# Altium project USB_TTL_1.1.PrjPcb
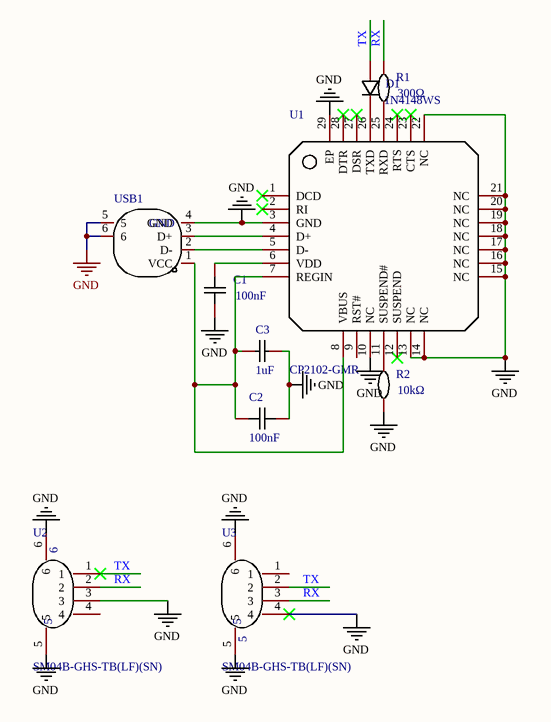
[diagram p0: usb_ttl.schdoc]
1 sheet, 10 parts. Net scope: global (net labels, ports and power ports of the same name join across sheets).
Board file: usb_ttl.pcbdoc

## Sheet usb_ttl.schdoc
size 309 x 223 mm; Symbol: Sheet-Symbol_A4; Device: Sheet-Symbol_A4; @Page Name: P1; @Create Date: 2023-03-03; @Page Count: 1; @Page No: 1; @Project Name: 防倒灌USB-TTL; @Schematic Name: Schematic1; @Update Date: 2023-03-03; Company: 嘉立创EDA; Page Size: A4; Version: V1.0; SheetNumber: 1; SheetTotal: 1

### Parts
C1  100nF  [C0402]
C2  100nF  [C0603]
C3  1uF  [C0603]
D1  1N4148WS  [SOD-323_L1.8-W1.3-LS2.5-RD]
R1  300Ω  [R0603]
R2  10kΩ  [R0402]
U1  CP2102-GMR  [WQFN-28_L5.0-W5.0-P0.50-BL-EP3.2]
U2  NAME: 5  NUMBER: 6  [CONN-SMD_4P-P1.25_SM04B-GHS-TB-LF-SN]  (hidden comment: SM04B-GHS-TB(LF)(SN))
U3  NAME: 5  [CONN-SMD_4P-P1.25_SM04B-GHS-TB-LF-SN]  (hidden comment: SM04B-GHS-TB(LF)(SN))
USB1  NAME: GND  [USB-A-SMD_917-P81A102ES60200]  (hidden comment: 917-P81A102ES60200)

### Nets
GND: C1.1 C2.1 C3.1 R2.1 U1.3(GND) U1.10(NC) U1.13(NC) U1.14(NC) U1.15(NC) U1.16(NC) U1.17(NC) U1.18(NC) U1.19(NC) U1.20(NC) U1.21(NC) U1.22(NC) U1.29(EP) U2.3 U2.5 U2.6 U3.4 U3.5 U3.6 USB1.4(GND) USB1.5 USB1.6
RX: R1.2 U2.2 U3.3
TX: D1.2(A) U2.1 U3.2
NetC1_2: C1.2 U1.6(VDD)
NetC2_2: C2.2 C3.2 U1.7(REGIN) U1.8(VBUS) USB1.1(VCC)
NetD1_1: D1.1(K) U1.26(TXD)
NetR1_1: R1.1 U1.25(RXD)
NetR2_2: R2.2 U1.11(SUSPEND#)
NetU1_4: U1.4(D+) USB1.3(D+)
NetU1_5: U1.5(D-) USB1.2(D-)

Not connected (* = marked no-connect by the designer): U1 1(DCD)* 2(RI)* 9(RST#) 12(SUSPEND)* 23(CTS)* 24(RTS)* 27(DSR)* 28(DTR)*; U2 4; U3 1

### Notes on the sheet
- 1
- 2
- 3
- 4
- 5
- 6
- A
- B
- C
- Schematic
- Schematic1
- Create Date
- Update Date
- 2023-03-03
- Reviewed
- Drawed
- Page
- P1
- Part Number
- 防倒灌USB-TTL
- D
- VER
- SIZE
- PAGE
- OF
- V1.0
- A4
- 嘉立创EDA

### Library data of the parts
C1 = CL05B104KB54PNC: 容值:100nF;精度:±10%;额定电压:50V;材质(温度系数):X7R;; Manufacturer: SAMSUNG(三星); Add into BOM: yes; Tolerance: ±10%; Voltage Rated: 50V; Temperature Coefficient: X7R; Name: 100nF; Symbol: CL05B104KB54PNC; Device: CL05B104KB54PNC; LCSC Part Name: 100nF ±10% 50V; Supplier Part: C307331; Manufacturer Part: CL05B104KB54PNC; Supplier Footprint: 0402; JLCPCB Part Class: Basic Part; Datasheet: https://atta.szlcsc.com/upload/public/pdf/source/20181009/C307331_222F7C870FD3EA5F46F538B483443886.pdf; Supplier: LCSC; Convert to PCB: yes; Value: 100nF
C2 = CC0603KRX7R9BB104: 容值:100nF;精度:±10%;额定电压:50V;材质(温度系数):X7R;; Manufacturer: YAGEO(国巨); Add into BOM: yes; Tolerance: ±10%; Voltage Rated: 50V; Temperature Coefficient: X7R; Name: 100nF; Symbol: CC0603KRX7R9BB104; Device: CC0603KRX7R9BB104; LCSC Part Name: 100nF ±10% 50V; Supplier Part: C14663; Manufacturer Part: CC0603KRX7R9BB104; Supplier Footprint: 0603; JLCPCB Part Class: Basic Part; Datasheet: https://atta.szlcsc.com/upload/public/pdf/source/20170116/1484561234239.pdf; Supplier: LCSC; Convert to PCB: yes; Value: 100nF
C3 = CL10A105KB8NNNC: 容值:1uF;精度:±10%;额定电压:50V;材质(温度系数):X5R;; Manufacturer: SAMSUNG(三星); Add into BOM: yes; Tolerance: ±10%; Voltage Rated: 50V; Temperature Coefficient: X5R; Name: 1uF; Symbol: CL10A105KB8NNNC; Device: CL10A105KB8NNNC; LCSC Part Name: 1uF ±10% 50V; Supplier Part: C15849; Manufacturer Part: CL10A105KB8NNNC; Supplier Footprint: 0603; JLCPCB Part Class: Basic Part; Datasheet: https://atta.szlcsc.com/upload/public/pdf/source/20160103/1457707679084.pdf; Supplier: LCSC; Convert to PCB: yes; Value: 1uF
D1 = 1N4148WS_C2128: 二极管配置:独立式;功率:200mW;直流反向耐压(Vr):100V;平均整流电流(Io):150mA;正向压降(Vf):1.25V@150mA;反向电流(Ir):1uA@75V;反向恢复时间(trr):4ns;工作温度:+150℃@(Tj);; Manufacturer: CJ(江苏长电/长晶); Symbol: 1N4148WS T4; Add into BOM: yes; Diode Configuration: 独立式; Power Dissipation: 200mW; Reverse Voltage (Vr): 100V; Average Rectified Current (Io): 150mA; Reverse Recovery Time (trr): 4ns; Name: 1N4148WS; Device: 1N4148WS_C2128; LCSC Part Name: 100V 150mA 4ns T4; Supplier Part: C2128; Manufacturer Part: 1N4148WS; Supplier Footprint: SOD-323; JLCPCB Part Class: Basic Part; Datasheet: https://atta.szlcsc.com/upload/public/pdf/source/20140809/1457707208178.pdf; Supplier: LCSC; Convert to PCB: yes; Forward Voltage (Vf@If): 1.25V@150mA; Reverse Leakage Current: 1uA@75V; Operating Temperature: +150℃@(Tj)
R1 = 0603WAF3000T5E: 电阻类型:厚膜电阻;阻值:300Ω;精度:±1%;功率:100mW;温度系数:±100ppm/℃;最大工作电压:75V;工作温度范围:-55℃~+155℃;; Manufacturer: UNI-ROYAL(厚声); Add into BOM: yes; Tolerance: ±1%; Power(Watts): 100mW; Overload Voltage (Max): 75V; Name: 300Ω; Symbol: 0603WAF3000T5E; Device: 0603WAF3000T5E; LCSC Part Name: 300Ω ±1% 100mW; Supplier Part: C23025; Manufacturer Part: 0603WAF3000T5E; Supplier Footprint: 0603; JLCPCB Part Class: Basic Part; Datasheet: https://atta.szlcsc.com/upload/public/pdf/source/20200306/C422600_1E6D84923E4A46A82E41ADD87F860B5C.pdf; Supplier: LCSC; Convert to PCB: yes; Type: 厚膜电阻; Value: 300Ω; Temperature Coefficient: ±100ppm/℃; Operating Temperature Range: -55℃~+155℃
R2 = 0402WGF1002TCE: 电阻类型:厚膜电阻;阻值:10kΩ;精度:±1%;功率:62.5mW;温度系数:±100ppm/℃;最大工作电压:50V;工作温度范围:-55℃~+155℃;; Manufacturer: UNI-ROYAL(厚声); Add into BOM: yes; Tolerance: ±1%; Power(Watts): 62.5mW; Overload Voltage (Max): 50V; Name: 10kΩ; Symbol: 0402WGF1002TCE; Device: 0402WGF1002TCE; LCSC Part Name: 10kΩ ±1% 62.5mW; Supplier Part: C25744; Manufacturer Part: 0402WGF1002TCE; Supplier Footprint: 0402; JLCPCB Part Class: Basic Part; Datasheet: https://atta.szlcsc.com/upload/public/pdf/source/20200306/C422600_1E6D84923E4A46A82E41ADD87F860B5C.pdf; Supplier: LCSC; Convert to PCB: yes; Type: 厚膜电阻; Value: 10kΩ; Temperature Coefficient: ±100ppm/℃; Operating Temperature Range: -55℃~+155℃
U1 = CP2102-GMR: 类型:Transceiver;协议类别:USB;驱动器/接收器数:1/1;数据速率:1Mbps;; Manufacturer: SILICON LABS(芯科); Add into BOM: yes; Protocol: USB; Number of Drivers/Receivers: 1/1; Data Rate: 1Mbps; Supply Voltage: 3V ~ 3.6V; Name: CP2102-GMR; Symbol: CP2102-GMR; Device: CP2102-GMR; LCSC Part Name: CP2102-GMR; Supplier Part: C6568; Manufacturer Part: CP2102-GMR; Supplier Footprint: QFN-28(5x5); JLCPCB Part Class: Basic Part; Datasheet: https://atta.szlcsc.com/upload/public/pdf/source/20170103/1483439882795.pdf; Supplier: LCSC; Convert to PCB: yes; Type: Transceiver
U2 U3 = SM04B-GHS-TB(LF)(SN): 参考系列:GH;间距:1.25mm;插针结构:1x4P;排数:1;每排PIN数:4;行距:-;安装方式:-;触头材质:磷青铜;; Manufacturer: JST; Add into BOM: yes; Reference Series: GH; Pitch: 1.25mm; Pins Structure: 1x4P; Number of PINs Per Row: 4; Name: SM04B-GHS-TB(LF)(SN); Symbol: SM04B-GHS-TB(LF)(SN); Device: SM04B-GHS-TB(LF)(SN); LCSC Part Name: GH 1.25mm 1x4P; Supplier Part: C189895; Manufacturer Part: SM04B-GHS-TB(LF)(SN); Supplier Footprint: SMD,P=1.25mm; JLCPCB Part Class: Extended Part; Datasheet: https://atta.szlcsc.com/upload/public/pdf/source/20180327/C189895_E152F1273677DB005E39DD42455B7B10.pdf; Supplier: LCSC; Convert to PCB: yes; Number of Rows: 1; Row Spacing: -; Mounting Style: -; Contact Material: 磷青铜
  U3: NUMBER: 5
USB1 = 917-P81A102ES60200: 连接器类型:Type-A;标准:USB 2.0;公母:公头;触点数量:4;端口数量:1;安装方式:沉板;额定电流 - 电源:1.5A;工作温度范围:-;; Manufacturer: 精拓金; Add into BOM: yes; Connector Type: Type-A; Gender: 公头; Number of Contacts: 4; Number of Ports: 1; Current Rating - Power (Max): 1.5A; Name: 917-P81A102ES60200; Symbol: 917-P81A102ES60200; Device: 917-P81A102ES60200; LCSC Part Name: Type-A 公头 沉板 有孔铁壳带柱黑胶/24H; Supplier Part: C2763087; Manufacturer Part: 917-P81A102ES60200; Supplier Footprint: SMD; JLCPCB Part Class: Extended Part; Datasheet: https://atta.szlcsc.com/upload/public/pdf/source/20210526/C2763087_AA2AFCC8C4584FF12A3F9960AE4ACDBB.pdf; Supplier: LCSC; Convert to PCB: yes; Standard: USB 2.0; Mounting Style: 沉板; Operating Temperature Range: -